# Altium project TE0747.PrjPCB
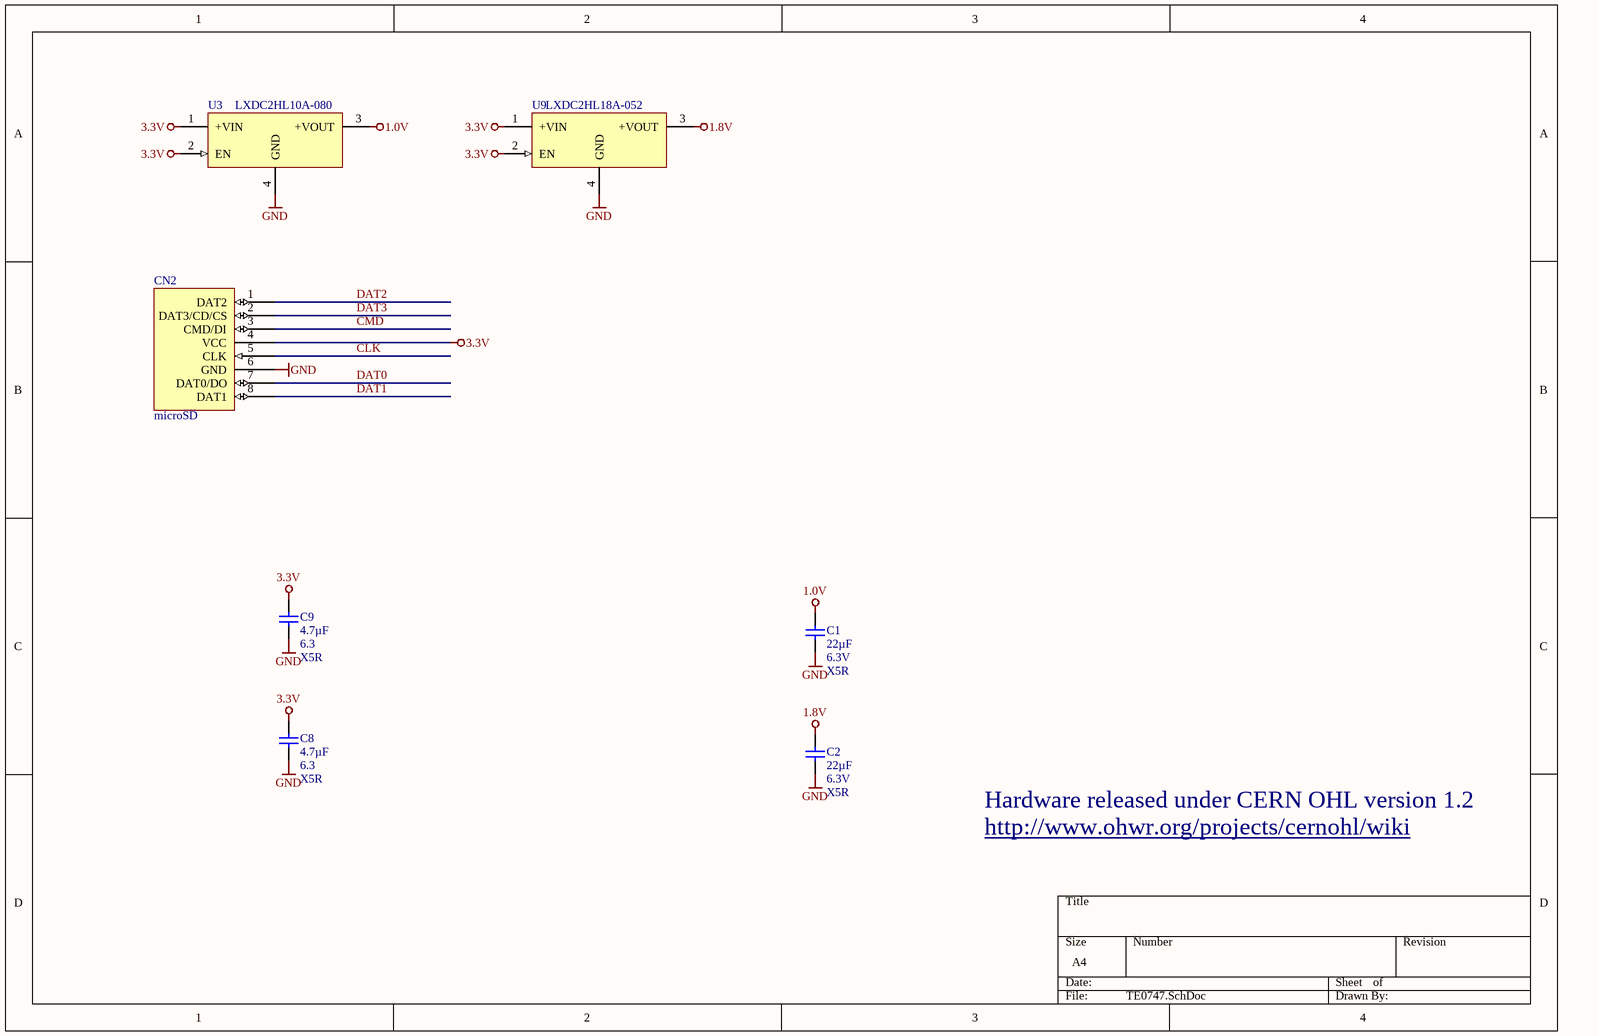
[diagram p0: TE0747.SchDoc]
6 sheets, 28 parts. Net scope: global (net labels, ports and power ports of the same name join across sheets).
Board file: TE0747.PcbDoc
Sheets:
  TE0747.SchDoc
  FPGA_B14_B16.SchDoc
  FPGA_B34_B35.SchDoc
  FPGA_CFG.SchDoc
  FPGA_GTP.SchDoc
  FPGA_PWR.SchDoc

## Sheet TE0747.SchDoc
size A4

### Parts
C1  22µF  Voltage: 6.3V  Technology: X5R  [CAPC1608X90N]
C2  22µF  Voltage: 6.3V  Technology: X5R  [CAPC1608X90N]
C8  4.7µF  Voltage: 6.3  Technology: X5R  [CAPC1005X60N]
C9  4.7µF  Voltage: 6.3  Technology: X5R  [CAPC1005X60N]
CN2  microSD  [uSD_PCB]
U3  LXDC2HL10A-080  [LXDC2HL]
U9  LXDC2HL18A-052  [LXDC2HL]

### Nets
1.0V: C1.1 U3.3(+VOUT)
1.8V: C2.1 U9.3(+VOUT)
3.3V: C8.1 C9.1 CN2.4(VCC) U3.1(+VIN) U3.2(EN) U9.1(+VIN) U9.2(EN)
GND: C1.2 C2.2 C8.2 C9.2 CN2.6(GND) U3.4(GND) U9.4(GND)
CLK: CN2.5(CLK)
CMD: CN2.3(CMD/DI)
DAT0: CN2.7(DAT0/DO)
DAT1: CN2.8(DAT1)
DAT2: CN2.1(DAT2)
DAT3: CN2.2(DAT3/CD/CS)

### Notes on the sheet
- Hardware released under CERN OHL version 1.2
- http://www.ohwr.org/projects/cernohl/wiki

### Library data of the parts
C1 C2 = 25400: KON 22µF 6,3V X5R SMD; AN: 25400; Mixed: SMT; Value: 22u; Case: 1608 (0603)
C8 C9 = 24719: KON 4.7µF 6.3V X5R SMD 20%; AN: 24719; Mixed: SMT; Value: 4.7u; Preferred: Yes; Case: 1005 (0402); Tolerance: 20%
CN2 = microSD_pads
U3 = 26786: AN: 26786; Mixed: SMT; Trenz-Stock: Yes; HelpURL: B:\AD\adlib\datasheet\LXDC2HL
U9 = 26785: AN: 26785; Mixed: SMT; Trenz-Stock: Yes; HelpURL: B:\AD\adlib\datasheet\LXDC2HL

## Sheet FPGA_B14_B16.SchDoc: TE0722
size A4; Organization: Trenz Electronic GmbH; DocumentNumber: 3; Revision: 01; SheetNumber: 3; SheetTotal: 8; Date: 07.11.2014; PageSetup: Record=PageOptions|CenterHorizontal=True|CenterVertical=True|PrintScale=0.96|XCorrection=1.00|YCorrection=1.00|PrintKind=0|BorderSize=5000000|LeftOffset=0|BottomOffset=0|Orientation=2|PaperLength=1000|PaperWidth=1000|Scale=100|PaperSource=7|PrintQuality=-4|MediaType=1|DitherType=10|PaperKind=A4|PrintScaleMode=1
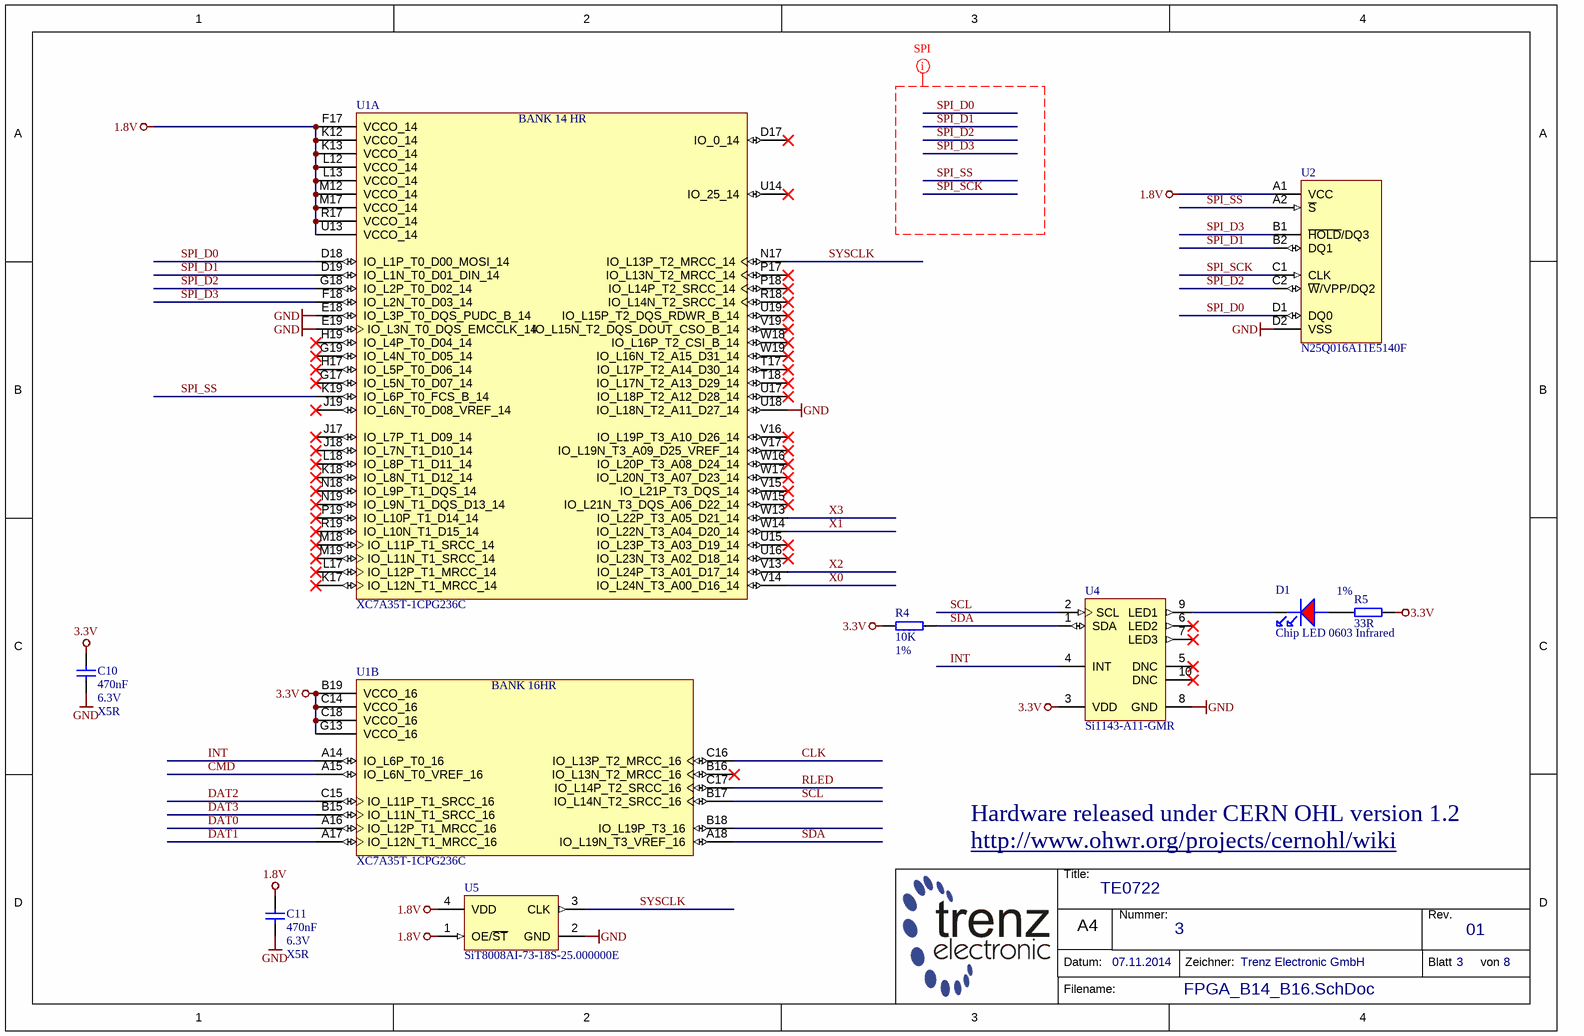
[diagram p1: FPGA_B14_B16.SchDoc]

### Parts
C10  470nF  Voltage: 6.3V  Technology: X5R  [CAPC0603X33N]
C11  470nF  Voltage: 6.3V  Technology: X5R  [CAPC0603X33N]
D1  Chip LED 0603 Infrared  [chipLED_0603_Red]
R4  10K  Tolerance: 1%  [RESC0603X26N]
R5  33R  Tolerance: 1%  [RESC1005X40N]
U1  XC7A35T-1CPG236C  [XC7AxxT-CPG236]  (parts A,B of 8)
U2  N25Q016A11E5140F  [BGA8C50P4X2_271X196X41B30N]
U4  Si1143-A11-GMR  [QFN50P200X200X75-10N]
U5  SiT8008AI-73-18S-25.000000E  [2016]

### Nets
1.8V: C11.1 U1.F17(VCCO_14) U1.K12(VCCO_14) U1.K13(VCCO_14) U1.L12(VCCO_14) U1.L13(VCCO_14) U1.M12(VCCO_14) U1.M17(VCCO_14) U1.R17(VCCO_14) U1.U13(VCCO_14) U2.A1(VCC) U5.1(OE/~{ST}) U5.4(VDD)
3.3V: C10.1 R4.1 R5.2 U1.B19(VCCO_16) U1.C14(VCCO_16) U1.C18(VCCO_16) U1.G13(VCCO_16) U4.3(VDD)
GND: C10.2 C11.2 U1.E18(IO_L3P_T0_DQS_PUDC_B_14) U1.E19(IO_L3N_T0_DQS_EMCCLK_14) U1.U18(IO_L18N_T2_A11_D27_14) U2.D2(VSS) U4.8(GND) U5.2(GND)
CLK: U1.C16(IO_L13P_T2_MRCC_16)
CMD: U1.A15(IO_L6N_T0_VREF_16)
DAT0: U1.A16(IO_L12P_T1_MRCC_16)
DAT1: U1.A17(IO_L12N_T1_MRCC_16)
DAT2: U1.C15(IO_L11P_T1_SRCC_16)
DAT3: U1.B15(IO_L11N_T1_SRCC_16)
INT: U1.A14(IO_L6P_T0_16) U4.4(INT)
RLED: U1.C17(IO_L14P_T2_SRCC_16)
SCL: U1.B17(IO_L14N_T2_SRCC_16) U4.2(SCL)
SDA: R4.2 U1.A18(IO_L19N_T3_VREF_16) U4.1(SDA)
SPI_D0: U1.D18(IO_L1P_T0_D00_MOSI_14) U2.D1(DQ0)
SPI_D1: U1.D19(IO_L1N_T0_D01_DIN_14) U2.B2(DQ1)
SPI_D2: U1.G18(IO_L2P_T0_D02_14) U2.C2(~{W}/VPP/DQ2)
SPI_D3: U1.F18(IO_L2N_T0_D03_14) U2.B1(~{HOLD}/DQ3)
SPI_SCK: U2.C1(CLK)
SPI_SS: U1.K19(IO_L6P_T0_FCS_B_14) U2.A2(~{S})
SYSCLK: U1.N17(IO_L13P_T2_MRCC_14) U5.3(CLK)
X0: U1.V14(IO_L24N_T3_A00_D16_14)
X1: U1.W14(IO_L22N_T3_A04_D20_14)
X2: U1.V13(IO_L24P_T3_A01_D17_14)
X3: U1.W13(IO_L22P_T3_A05_D21_14)
NetD1_A: D1.A R5.1
NetD1_K: D1.K U4.9(LED1)

Not connected (* = marked no-connect by the designer): U1 B16(IO_L13N_T2_MRCC_16)* B18(IO_L19P_T3_16) D17(IO_0_14)* G17(IO_L5N_T0_D07_14)* G19(IO_L4N_T0_D05_14)* H17(IO_L5P_T0_D06_14)* H19(IO_L4P_T0_D04_14)* J17(IO_L7P_T1_D09_14)* J18(IO_L7N_T1_D10_14)* J19(IO_L6N_T0_D08_VREF_14)* K17(IO_L12N_T1_MRCC_14)* K18(IO_L8N_T1_D12_14)* L17(IO_L12P_T1_MRCC_14)* L18(IO_L8P_T1_D11_14)* M18(IO_L11P_T1_SRCC_14)* M19(IO_L11N_T1_SRCC_14)* N18(IO_L9P_T1_DQS_14)* N19(IO_L9N_T1_DQS_D13_14)* P17(IO_L13N_T2_MRCC_14)* P18(IO_L14P_T2_SRCC_14)* P19(IO_L10P_T1_D14_14)* R18(IO_L14N_T2_SRCC_14)* R19(IO_L10N_T1_D15_14)* T17(IO_L17P_T2_A14_D30_14)* T18(IO_L17N_T2_A13_D29_14)* U14(IO_25_14)* U15(IO_L23P_T3_A03_D19_14)* U16(IO_L23N_T3_A02_D18_14)* U17(IO_L18P_T2_A12_D28_14)* U19(IO_L15P_T2_DQS_RDWR_B_14)* V15(IO_L21P_T3_DQS_14)* V16(IO_L19P_T3_A10_D26_14)* V17(IO_L19N_T3_A09_D25_VREF_14)* V19(IO_L15N_T2_DQS_DOUT_CSO_B_14)* W15(IO_L21N_T3_DQS_A06_D22_14)* W16(IO_L20P_T3_A08_D24_14)* W17(IO_L20N_T3_A07_D23_14)* W18(IO_L16P_T2_CSI_B_14)* W19(IO_L16N_T2_A15_D31_14)*; U4 5(DNC)* 6(LED2)* 7(LED3)* 10(DNC)*

### Layout directives
net class SPI: SPI_D0, SPI_D1, SPI_D2, SPI_D3, SPI_SCK, SPI_SS

### Notes on the sheet
- Hardware released under CERN OHL version 1.2
- http://www.ohwr.org/projects/cernohl/wiki
- Title:
- Nummer:
- Rev.
- Datum:
- A4
- Zeichner:
- Blatt
- von
- Filename:
- (in symbol 26752, part A) BANK 14 HR
- (in symbol 26752, part B) BANK 16HR

### Library data of the parts
C10 C11 = 24921: KON 470nF X5R 6.3V SMD 20%; AN: 24921; Mixed: SMT; Value: 470n; Preferred: Yes; Case: 0603 (0201); Tolerance: 20%
D1 = 26721: AN: 26721; Voltage: 1.2; Mixed: SMT; Preferred: Yes; Case: 0603; HelpURL: B:\AD\adlib\datasheet\APT1608F3C
R4 = 24914: WID SMD 10K 1% 0,05W; AN: 24914; Mixed: SMT; Preferred: Yes; Case: 0603 (0201); Value: 10K; HelpURL: B:\AD\adlib\datasheet\R0201
R5 = 22770: WID SMD 33R 1% 0,063W; AN: 22770; Mixed: SMT; Value: 33; Preferred: Yes; Case: 1005 (0402)
U1 = 26752: AN: 26752; Mixed: SMT; Trenz-Stock: Yes; Case: CPG236; HelpURL: B:\ad\adlib\datasheet\XC7
U2 = 26788: AN: 26788; Mixed: SMT; Trenz-Stock: Yes; Case: CSPBGA , XFBGA 8; HelpURL: B:\AD\adlib\datasheet\N25Q016A11E; Preferred: Yes
U4 = 26318: AN: 26318; Mixed: AMT; Case: QFN10; HelpURL: B:\AD\adlib\datasheet\Si1141x
U5 = 26674: SiT8008AI-73-18S-25.000000E MEMS Oszillator 25MHz; AN: 26674; Voltage: 1.8V; Mixed: SMT; Trenz-Stock: Yes; Value: 25M; Case: 2.0  x 1.6mm; HelpURL: B:\AD\adlib\datasheet\SiT8008; Preferred: Yes

## Sheet FPGA_B34_B35.SchDoc: TE0722
size A4; Organization: Trenz Electronic GmbH; DocumentNumber: 2; Revision: 01; SheetNumber: 2; SheetTotal: 8; Date: 07.11.2014; PageSetup: Record=PageOptions|CenterHorizontal=True|CenterVertical=True|PrintScale=0.96|XCorrection=1.00|YCorrection=1.00|PrintKind=0|BorderSize=5000000|LeftOffset=0|BottomOffset=0|Orientation=2|PaperLength=1000|PaperWidth=1000|Scale=100|PaperSource=7|PrintQuality=-4|MediaType=1|DitherType=10|PaperKind=A4|PrintScaleMode=1
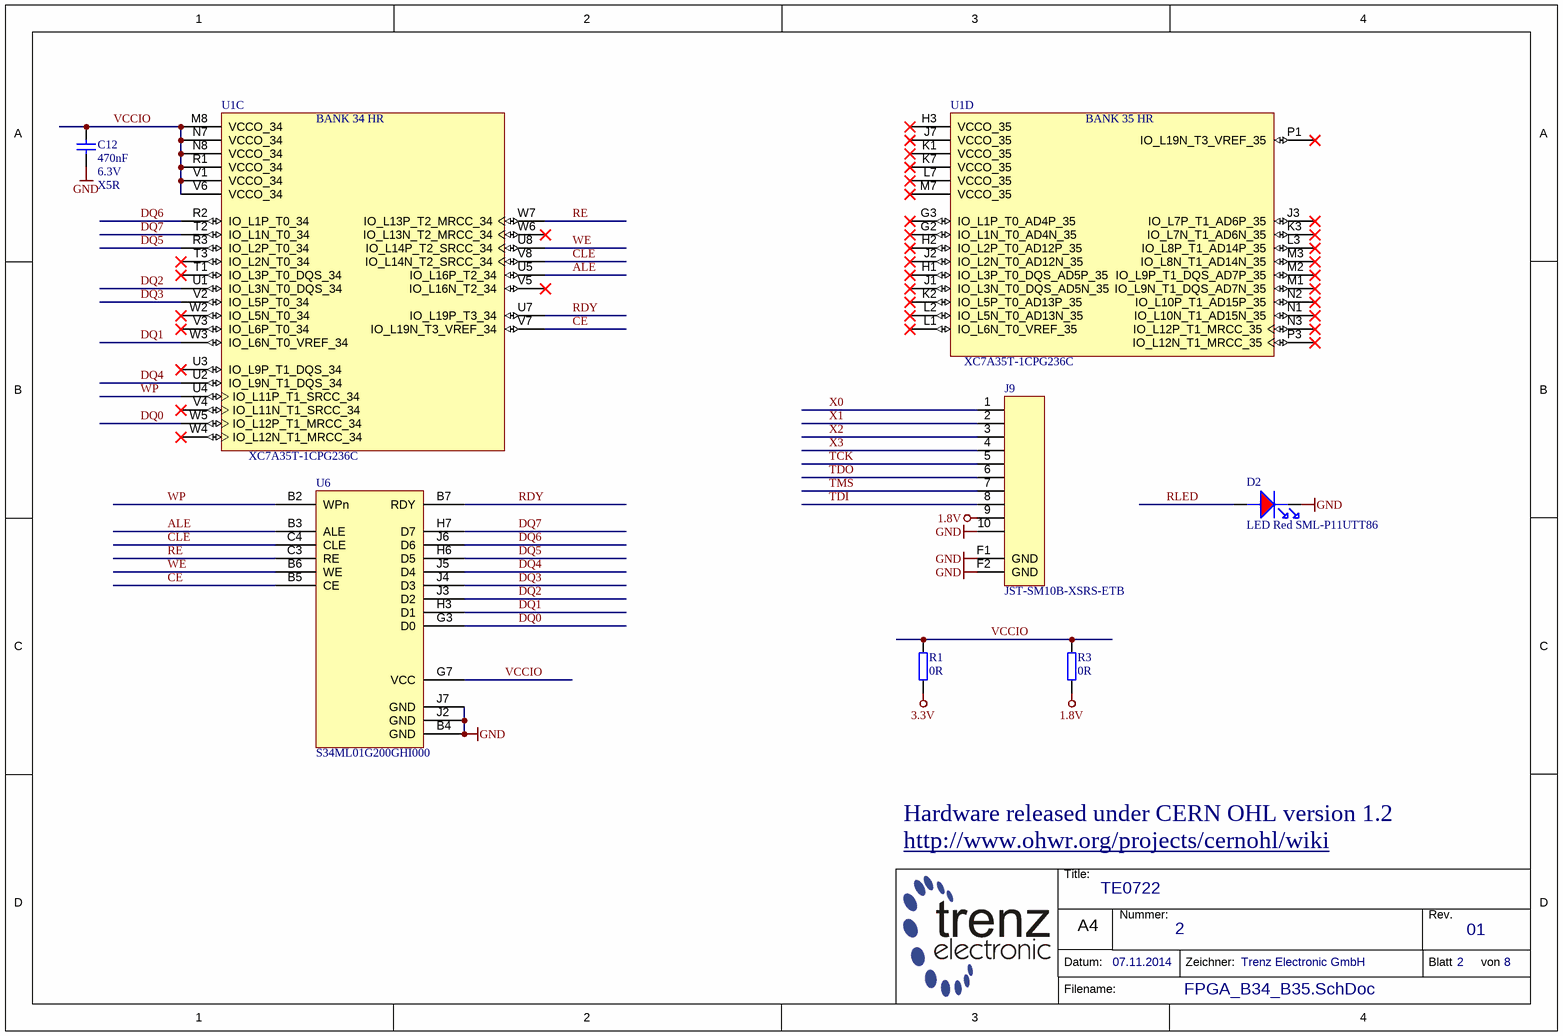
[diagram p2: FPGA_B34_B35.SchDoc]

### Parts
C12  470nF  Voltage: 6.3V  Technology: X5R  [CAPC0603X33N]
D2  LED Red SML-P11UTT86  [LEDC1006X25N_RED]
J9  JST-SM10B-XSRS-ETB  [JST-SM10B-XSRS-ETB]
R1  0R  [RESC0603X26N]
R3  0R  [RESC0603X26N]
U1  XC7A35T-1CPG236C  [XC7AxxT-CPG236]  (parts C,D of 8)
U6  S34ML01G200GHI000  [BGA67C80P10X8_800X650X100B46N]

### Nets
1.8V: J9.9 R3.2
3.3V: R1.2
GND: C12.2 D2.K J9.10 J9.F1(GND) J9.F2(GND) U6.B4(GND) U6.J2(GND) U6.J7(GND)
ALE: U1.U5(IO_L16P_T2_34) U6.B3(ALE)
CE: U1.V7(IO_L19N_T3_VREF_34) U6.B5(CE)
CLE: U1.V8(IO_L14N_T2_SRCC_34) U6.C4(CLE)
DQ0: U1.W5(IO_L12P_T1_MRCC_34) U6.G3(D0)
DQ1: U1.W3(IO_L6N_T0_VREF_34) U6.H3(D1)
DQ2: U1.U1(IO_L3N_T0_DQS_34) U6.J3(D2)
DQ3: U1.V2(IO_L5P_T0_34) U6.J4(D3)
DQ4: U1.U2(IO_L9N_T1_DQS_34) U6.J5(D4)
DQ5: U1.R3(IO_L2P_T0_34) U6.H6(D5)
DQ6: U1.R2(IO_L1P_T0_34) U6.J6(D6)
DQ7: U1.T2(IO_L1N_T0_34) U6.H7(D7)
RDY: U1.U7(IO_L19P_T3_34) U6.B7(RDY)
RE: U1.W7(IO_L13P_T2_MRCC_34) U6.C3(RE)
RLED: D2.A
TCK: J9.5
TDI: J9.8
TDO: J9.6
TMS: J9.7
VCCIO: C12.1 R1.1 R3.1 U1.M8(VCCO_34) U1.N7(VCCO_34) U1.N8(VCCO_34) U1.R1(VCCO_34) U1.V1(VCCO_34) U1.V6(VCCO_34) U6.G7(VCC)
WE: U1.U8(IO_L14P_T2_SRCC_34) U6.B6(WE)
WP: U1.U4(IO_L11P_T1_SRCC_34) U6.B2(WPn)
X0: J9.1
X1: J9.2
X2: J9.3
X3: J9.4

Not connected (* = marked no-connect by the designer): U1 G2(IO_L1N_T0_AD4N_35)* G3(IO_L1P_T0_AD4P_35)* H1(IO_L3P_T0_DQS_AD5P_35)* H2(IO_L2P_T0_AD12P_35)* H3(VCCO_35)* J1(IO_L3N_T0_DQS_AD5N_35)* J2(IO_L2N_T0_AD12N_35)* J3(IO_L7P_T1_AD6P_35)* J7(VCCO_35)* K1(VCCO_35)* K2(IO_L5P_T0_AD13P_35)* K3(IO_L7N_T1_AD6N_35)* K7(VCCO_35)* L1(IO_L6N_T0_VREF_35)* L2(IO_L5N_T0_AD13N_35)* L3(IO_L8P_T1_AD14P_35)* L7(VCCO_35)* M1(IO_L9N_T1_DQS_AD7N_35)* M2(IO_L9P_T1_DQS_AD7P_35)* M3(IO_L8N_T1_AD14N_35)* M7(VCCO_35)* N1(IO_L10N_T1_AD15N_35)* N2(IO_L10P_T1_AD15P_35)* N3(IO_L12P_T1_MRCC_35)* P1(IO_L19N_T3_VREF_35)* P3(IO_L12N_T1_MRCC_35)* T1(IO_L3P_T0_DQS_34)* T3(IO_L2N_T0_34)* U3(IO_L9P_T1_DQS_34)* V3(IO_L6P_T0_34)* V4(IO_L11N_T1_SRCC_34)* V5(IO_L16N_T2_34)* W2(IO_L5N_T0_34)* W4(IO_L12N_T1_MRCC_34)* W6(IO_L13N_T2_MRCC_34)*

### Notes on the sheet
- Hardware released under CERN OHL version 1.2
- http://www.ohwr.org/projects/cernohl/wiki
- Title:
- Nummer:
- Rev.
- Datum:
- A4
- Zeichner:
- Blatt
- von
- Filename:
- (in symbol 26752, part C) BANK 34 HR
- (in symbol 26752, part D) BANK 35 HR

### Library data of the parts
C12 = 24921: as C10 on sheet FPGA_B14_B16; Case: 0603 (0201); Tolerance: 20%
D2 = 24212: LED Rot SML-P11UTT86 SMD; AN: 24212; Mixed: SMT; Preferred: Yes; Case: 1005 (0402); HelpURL: B:\AD\adlib\datasheet\SML-P1
J9 = 25616: JST 10Pol. 0.6mm RA; AN: 25616; Mixed: SMT; Trenz-Stock: Yes; HelpURL: B:\AD\adlib\datasheet\SMxxB-XSRS-ETB
R1 R3 = 26259: WID SMD 0R 0,05W SMD; AN: 26259; Mixed: SMT; Value: 0; Preferred: Yes; Case: 0603 (0201); HelpURL: B:\AD\adlib\datasheet\R0201
U1 = 26752: AN: 26752; Mixed: SMT; Trenz-Stock: Yes; Case: CPG236; HelpURL: B:\ad\adlib\datasheet\XC7
U6 = 26787: AN: 26787; Mixed: SMT; Trenz-Stock: Yes; Case: BGA67; HelpURL: B:\AD\adlib\datasheet\S34ML0xG2

## Sheet FPGA_CFG.SchDoc: TE0722
size A4; Organization: Trenz Electronic GmbH; DocumentNumber: 4; Revision: 01; SheetNumber: 4; SheetTotal: 8; Date: 07.11.2014; PageSetup: Record=PageOptions|CenterHorizontal=True|CenterVertical=True|PrintScale=0.96|XCorrection=1.00|YCorrection=1.00|PrintKind=0|BorderSize=5000000|LeftOffset=0|BottomOffset=0|Orientation=2|PaperLength=1000|PaperWidth=1000|Scale=100|PaperSource=7|PrintQuality=-4|MediaType=1|DitherType=10|PaperKind=A4|PrintScaleMode=1
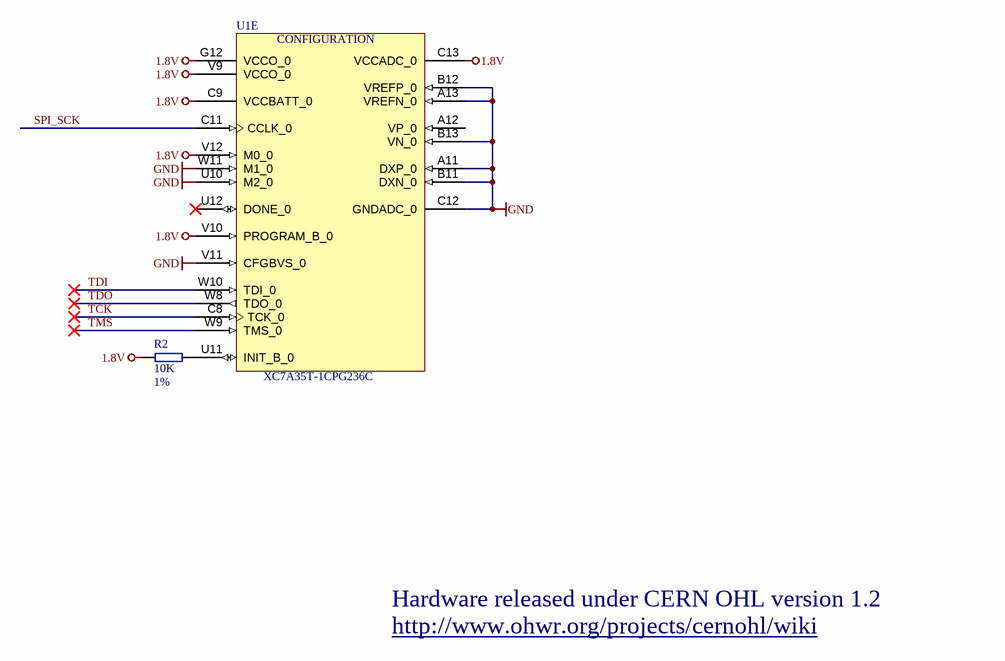
[diagram p3: FPGA_CFG.SchDoc]

### Parts
R2  10K  Tolerance: 1%  [RESC0603X26N]
U1  XC7A35T-1CPG236C  [XC7AxxT-CPG236]  (part E of 8)

### Nets
1.8V: R2.1 U1.C9(VCCBATT_0) U1.C13(VCCADC_0) U1.G12(VCCO_0) U1.V9(VCCO_0) U1.V10(PROGRAM_B_0) U1.V12(M0_0)
GND: U1.A11(DXP_0) U1.A13(VREFN_0) U1.B11(DXN_0) U1.B12(VREFP_0) U1.B13(VN_0) U1.C12(GNDADC_0) U1.U10(M2_0) U1.V11(CFGBVS_0) U1.W11(M1_0)
SPI_SCK: U1.C11(CCLK_0)
TCK: U1.C8(TCK_0)
TDI: U1.W10(TDI_0)
TDO: U1.W8(TDO_0)
TMS: U1.W9(TMS_0)
NetR2_2: R2.2 U1.U11(INIT_B_0)

Not connected (* = marked no-connect by the designer): U1 A12(VP_0) U12(DONE_0)*

### Notes on the sheet
- Hardware released under CERN OHL version 1.2
- http://www.ohwr.org/projects/cernohl/wiki
- Title:
- Nummer:
- Rev.
- Datum:
- A4
- Zeichner:
- Blatt
- von
- Filename:
- (in symbol 26752, part E) CONFIGURATION

### Library data of the parts
R2 = 24914: as R4 on sheet FPGA_B14_B16; Case: 0603 (0201); Value: 10K; HelpURL: B:\AD\adlib\datasheet\R0201
U1 = 26752: AN: 26752; Mixed: SMT; Trenz-Stock: Yes; Case: CPG236; HelpURL: B:\ad\adlib\datasheet\XC7

## Sheet FPGA_GTP.SchDoc: TE0723 - FPGA RAM
size A4; PageSetup: Record=PageOptions|CenterHorizontal=True|CenterVertical=True|PrintScale=0.96|XCorrection=1.00|YCorrection=1.00|PrintKind=0|BorderSize=5000000|LeftOffset=0|BottomOffset=0|Orientation=2|PaperLength=1000|PaperWidth=1000|Scale=100|PaperSource=7|PrintQuality=-4|MediaType=1|DitherType=10|PaperKind=A4|PrintScaleMode=1; Organization: Trenz Electronic GmbH; DocumentNumber: TE0723; Revision: 01; SheetNumber: 6; SheetTotal: 12; Date: 08.07.2015; Author: Indrek Tubalkain; CompanyName: Trenz Electronic GmbH; DrawnBy: Indrek Tubalkain; Engineer: Indrek Tubalkain; ProjectName: TE0723 Arduino
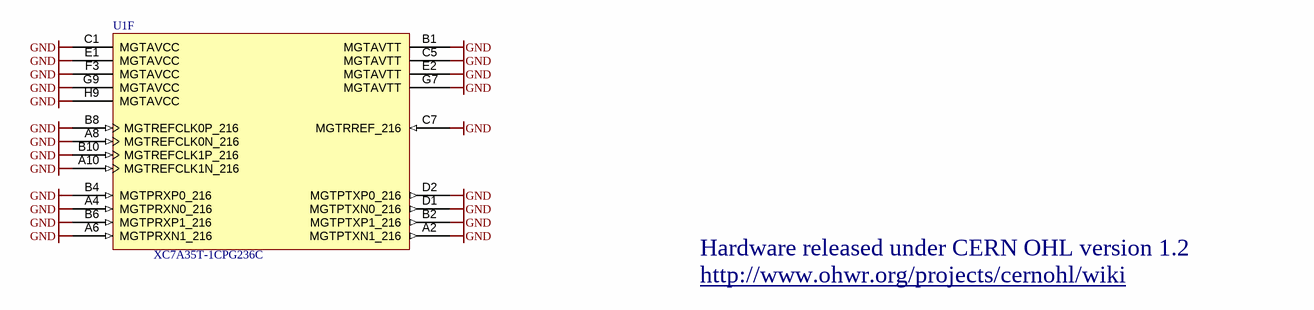
[diagram p4: FPGA_GTP.SchDoc]

### Parts
U1  XC7A35T-1CPG236C  [XC7AxxT-CPG236]  (part F of 8)

### Nets
GND: U1.A2(MGTPTXN1_216) U1.A4(MGTPRXN0_216) U1.A6(MGTPRXN1_216) U1.A8(MGTREFCLK0N_216) U1.A10(MGTREFCLK1N_216) U1.B1(MGTAVTT) U1.B2(MGTPTXP1_216) U1.B4(MGTPRXP0_216) U1.B6(MGTPRXP1_216) U1.B8(MGTREFCLK0P_216) U1.B10(MGTREFCLK1P_216) U1.C1(MGTAVCC) U1.C5(MGTAVTT) U1.C7(MGTRREF_216) U1.D1(MGTPTXN0_216) U1.D2(MGTPTXP0_216) U1.E1(MGTAVCC) U1.E2(MGTAVTT) U1.F3(MGTAVCC) U1.G7(MGTAVTT) U1.G9(MGTAVCC) U1.H9(MGTAVCC)

### Notes on the sheet
- Hardware released under CERN OHL version 1.2
- http://www.ohwr.org/projects/cernohl/wiki
- Title:
- Number:
- Rev.
- Date:
- A4
- Copyright:
- Page
- of
- Filename:

### Library data of the parts
U1 = 26752: AN: 26752; Mixed: SMT; Trenz-Stock: Yes; Case: CPG236; HelpURL: B:\ad\adlib\datasheet\XC7

## Sheet FPGA_PWR.SchDoc: TE0722
size A4; Organization: Trenz Electronic GmbH; DocumentNumber: 6; Revision: 01; SheetNumber: 6; SheetTotal: 8; Date: 07.11.2014; PageSetup: Record=PageOptions|CenterHorizontal=True|CenterVertical=True|PrintScale=0.96|XCorrection=1.00|YCorrection=1.00|PrintKind=0|BorderSize=5000000|LeftOffset=0|BottomOffset=0|Orientation=2|PaperLength=1000|PaperWidth=1000|Scale=100|PaperSource=7|PrintQuality=-4|MediaType=1|DitherType=10|PaperKind=A4|PrintScaleMode=1
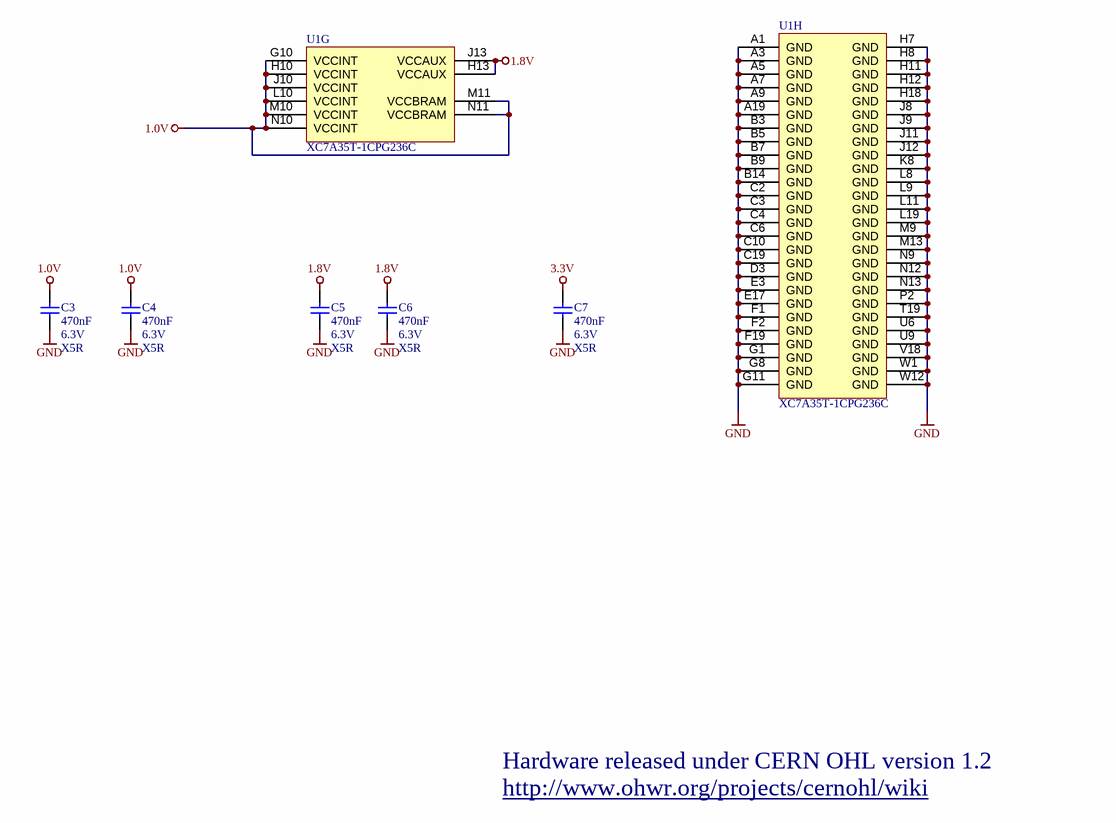
[diagram p5: FPGA_PWR.SchDoc]

### Parts
C3  470nF  Voltage: 6.3V  Technology: X5R  [CAPC0603X33N]
C4  470nF  Voltage: 6.3V  Technology: X5R  [CAPC0603X33N]
C5  470nF  Voltage: 6.3V  Technology: X5R  [CAPC0603X33N]
C6  470nF  Voltage: 6.3V  Technology: X5R  [CAPC0603X33N]
C7  470nF  Voltage: 6.3V  Technology: X5R  [CAPC0603X33N]
U1  XC7A35T-1CPG236C  [XC7AxxT-CPG236]  (parts G,H of 8)

### Nets
1.0V: C3.1 C4.1 U1.G10(VCCINT) U1.H10(VCCINT) U1.J10(VCCINT) U1.L10(VCCINT) U1.M10(VCCINT) U1.M11(VCCBRAM) U1.N10(VCCINT) U1.N11(VCCBRAM)
1.8V: C5.1 C6.1 U1.H13(VCCAUX) U1.J13(VCCAUX)
3.3V: C7.1
GND: C3.2 C4.2 C5.2 C6.2 C7.2 U1.A1(GND) U1.A3(GND) U1.A5(GND) U1.A7(GND) U1.A9(GND) U1.A19(GND) U1.B3(GND) U1.B5(GND) U1.B7(GND) U1.B9(GND) U1.B14(GND) U1.C2(GND) U1.C3(GND) U1.C4(GND) U1.C6(GND) U1.C10(GND) U1.C19(GND) U1.D3(GND) U1.E3(GND) U1.E17(GND) U1.F1(GND) U1.F2(GND) U1.F19(GND) U1.G1(GND) U1.G8(GND) U1.G11(GND) U1.H7(GND) U1.H8(GND) U1.H11(GND) U1.H12(GND) U1.H18(GND) U1.J8(GND) U1.J9(GND) U1.J11(GND) U1.J12(GND) U1.K8(GND) U1.L8(GND) U1.L9(GND) U1.L11(GND) U1.L19(GND) U1.M9(GND) U1.M13(GND) U1.N9(GND) U1.N12(GND) U1.N13(GND) U1.P2(GND) U1.T19(GND) U1.U6(GND) U1.U9(GND) U1.V18(GND) U1.W1(GND) U1.W12(GND)

### Notes on the sheet
- Hardware released under CERN OHL version 1.2
- http://www.ohwr.org/projects/cernohl/wiki
- Title:
- Nummer:
- Rev.
- Datum:
- A4
- Zeichner:
- Blatt
- von
- Filename:

### Library data of the parts
C3-C7 = 24921: as C10 on sheet FPGA_B14_B16; Case: 0603 (0201); Tolerance: 20%
U1 = 26752: AN: 26752; Mixed: SMT; Trenz-Stock: Yes; Case: CPG236; HelpURL: B:\ad\adlib\datasheet\XC7

## Nets that join several sheets
1.0V: TE0747 (C1.1 U3.3), FPGA_PWR (10 pins)
1.8V: TE0747 (C2.1 U9.3), FPGA_B14_B16 (13 pins), FPGA_B34_B35 (J9.9 R3.2), FPGA_CFG (7 pins), FPGA_PWR (C5.1 C6.1 U1.H13 U1.J13)
3.3V: TE0747 (7 pins), FPGA_B14_B16 (8 pins), FPGA_B34_B35 (R1.2), FPGA_PWR (C7.1)
GND: TE0747 (7 pins), FPGA_B14_B16 (8 pins), FPGA_B34_B35 (8 pins), FPGA_CFG (9 pins), FPGA_GTP (22 pins), FPGA_PWR (57 pins)
CLK: TE0747 (CN2.5), FPGA_B14_B16 (U1.C16)
CMD: TE0747 (CN2.3), FPGA_B14_B16 (U1.A15)
DAT0: TE0747 (CN2.7), FPGA_B14_B16 (U1.A16)
DAT1: TE0747 (CN2.8), FPGA_B14_B16 (U1.A17)
DAT2: TE0747 (CN2.1), FPGA_B14_B16 (U1.C15)
DAT3: TE0747 (CN2.2), FPGA_B14_B16 (U1.B15)
RLED: FPGA_B14_B16 (U1.C17), FPGA_B34_B35 (D2.A)
SPI_SCK: FPGA_B14_B16 (U2.C1), FPGA_CFG (U1.C11)
TCK: FPGA_B34_B35 (J9.5), FPGA_CFG (U1.C8)
TDI: FPGA_B34_B35 (J9.8), FPGA_CFG (U1.W10)
TDO: FPGA_B34_B35 (J9.6), FPGA_CFG (U1.W8)
TMS: FPGA_B34_B35 (J9.7), FPGA_CFG (U1.W9)
X0: FPGA_B14_B16 (U1.V14), FPGA_B34_B35 (J9.1)
X1: FPGA_B14_B16 (U1.W14), FPGA_B34_B35 (J9.2)
X2: FPGA_B14_B16 (U1.V13), FPGA_B34_B35 (J9.3)
X3: FPGA_B14_B16 (U1.W13), FPGA_B34_B35 (J9.4)